# Altium schematic sheet BMS_V4.SchDoc
size A; SheetNumber: 1; SheetTotal: 1
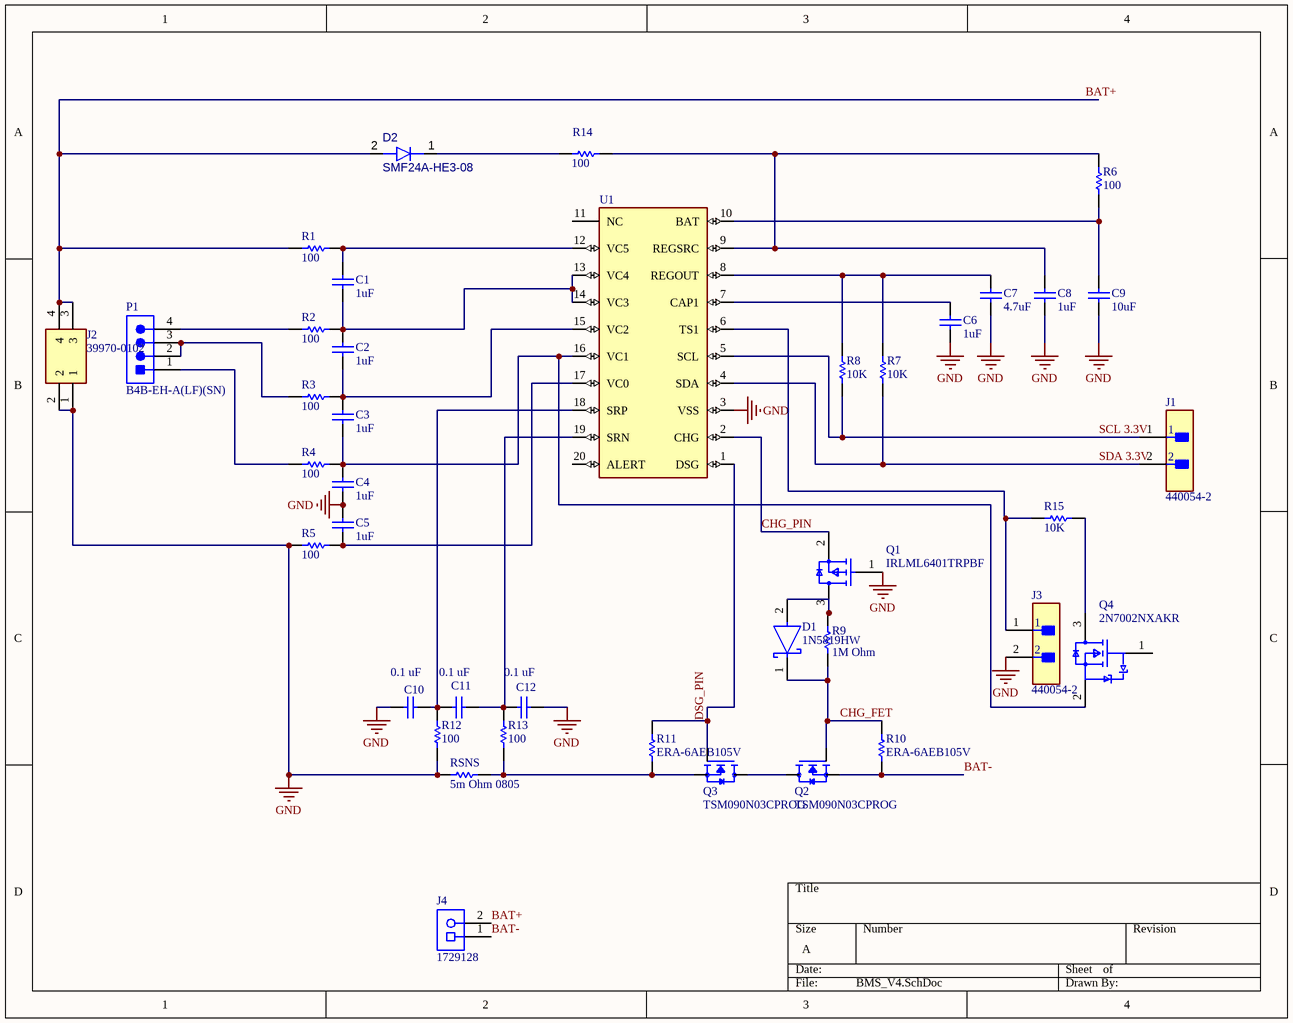
[diagram p0: BMS_V4.SchDoc]

## Parts
C1  1uF  [CAPC2013X140X50LL20T25]
C2  1uF  [CAPC2013X140X50LL20T25]
C3  1uF  [CAPC2013X140X50LL20T25]
C4  1uF  [CAPC2013X140X50LL20T25]
C5  1uF  [CAPC2013X140X50LL20T25]
C6  1uF  [CAPC2013X140X50LL20T25]
C7  4.7uF  [CAPC2013X140X50LL20T25]
C8  1uF  [CAPC2013X140X50LL20T25]
C9  10uF  [CAPC2013X140X50LL20T25]
C10  0.1 uF  [CAPC2013X140X50LL20T25]
C11  0.1 uF  [CAPC2013X140X50LL20T25]
C12  0.1 uF  [CAPC2013X140X50LL20T25]
D1  1N5819HW  [FP-SOD123-IPC_A]
D2  SMF24A-HE3-08  [DIOM2818X11N]
J1  440054-2  [FP-440054-2-MFG]
J2  39970-0102  [399700102]
J3  440054-2  [FP-440054-2-MFG]
J4  1729128  [PHOE-1729128-2_V]
P1  B4B-EH-A(LF)(SN)  [JST-B4B-EH-A_V]
Q1  IRLML6401TRPBF  [FP-SOT23-MFG]
Q2  TSM090N03CPROG  [TRANS_TSM090N03CPROG]
Q3  TSM090N03CPROG  [TRANS_TSM090N03CPROG]
Q4  2N7002NXAKR  [FP-SOT23-IPC_B]
R1  100  [RESC2013X60X30ML20T20]
R2  100  [RESC2013X60X30ML20T20]
R3  100  [RESC2013X60X30ML20T20]
R4  100  [RESC2013X60X30ML20T20]
R5  100  [RESC2013X60X30ML20T20]
R6  100  [RESC2013X60X30ML20T20]
R7  10K  [RESC2013X60X30ML20T20]
R8  10K  [RESC2013X60X30ML20T20]
R9  1M Ohm  [RESC2013X60X40LL20T25]
R10  ERA-6AEB105V  [RESC2013X60X40LL20T25]
R11  ERA-6AEB105V  [RESC2013X60X40LL20T25]
R12  100  [RESC2013X50X30LL20T20]
R13  100  [RESC2013X50X30LL20T20]
R14  100  [RESC2013X60X30ML20T20]
R15  10K  [RESC2013X60X35NL10T20]
RSNS  5m Ohm 0805  [RESC2013X60X30ML20T20]
U1  (no value)  [BQ7692006PW]

## Nets
GND: C4.1 C5.2 C6.1 C7.1 C8.1 C9.1 C10.2 C12.1 J2.1 J2.2 J3.2 Q1.1(G) R5.1 R12.1 RSNS.2 U1.3(VSS)
BAT+: D2.2(A) J2.3 J2.4 J4.2 R1.1
BAT-: J4.1 Q2.3(S) R10.1
CHG_FET: D1.1(C) Q2.1(G) R9.1 R10.2
CHG_PIN: Q1.2(S) U1.2(CHG)
DSG_PIN: Q3.1(G) R11.2 U1.1(DSG)
SCL 3.3V: J1.1 R8.1 U1.5(SCL)
SDA 3.3V: J1.2 R7.1 U1.4(SDA)
NetC1_1: C1.1 C2.2 R2.2 U1.13(VC4) U1.14(VC3)
NetC1_2: C1.2 R1.2 U1.12(VC5)
NetC2_1: C2.1 C3.2 R3.2 U1.15(VC2)
NetC3_1: C3.1 C4.2 Q4.2(S) R4.2 U1.16(VC1)
NetC5_1: C5.1 R5.2 U1.17(VC0)
NetC6_2: C6.2 U1.7(CAP1)
NetC7_2: C7.2 R7.2 R8.2 U1.8(REGOUT)
NetC8_2: C8.2 R6.2 R14.1 U1.9(REGSRC)
NetC9_2: C9.2 R6.1 U1.10(BAT)
NetC10_1: C10.1 C11.2 R12.2 U1.18(SRP)
NetC11_1: C11.1 C12.2 R13.2 U1.19(SRN)
NetD1_2: D1.2(A) Q1.3(D) R9.2
NetD2_1: D2.1(K) R14.2
NetJ3_1: J3.1 R15.1 U1.6(TS1)
NetP1_1: P1.1 R4.1
NetP1_2: P1.2 P1.3 R3.1
NetP1_4: P1.4 R2.1
NetQ2_2: Q2.2(D) Q3.2(D)
NetQ3_3: Q3.3(S) R11.1 R13.1 RSNS.1
NetQ4_3: Q4.3(D) R15.2

Not connected (* = marked no-connect by the designer): Q4 1(G); U1 11(NC) 20(ALERT)

## Library data of the parts
C1-C12 = CMP-2007-03234-1: Part Number: C0805C105K3RACTU; Manufacturer: Kemet
D1 = CMP-0303-00003-3: DIODE SCHOTTKY 40V 1A SOD123; Forward Voltage: 450mV; Capacitance: 110pF; Max Forward Surge Current (Ifsm): 25A; Peak Reverse Current: 50uA; Polarity: Standard; Element Configuration: Single; Max Power Dissipation: 450mW; Min Operating Temperature: -65°C; Package Quantity: 3000; Contact Plating: Tin; Weight: 0.000353oz; Max Repetitive Reverse Voltage (Vrrm): 40V; Max Reverse Voltage (DC): 40V; Height: 1.25mm; Average Rectified Current: 1A; Width: 1.7mm; Case/Package: SOD-123-2; Lead Free: Lead Free; Max Operating Temperature: 125°C; Current Rating: 1A; Termination: SMD/SMT; Forward Current: 1A; Radiation Hardening: No; Number of Pins: 2; Length: 2.85mm; Voltage Rating (DC): 40V; REACH SVHC: No SVHC; Peak Non-Repetitive Surge Current: 25A; Packaging: Tape and Reel; Output Current: 1A
D2 = CMP-004-00031-1: Trans Voltage Suppressor Diode, 1000W, 24V V(RWM), Unidirectional, 1 Element, Silicon, DO-219AB; RoHS Compliant: Yes; Pins: 2; Min Operating Temperature: -55°C; Max Operating Temperature: 150°C
J1 J3 = CMP-03369-000005-1: CONN HEADER VERT 2POS 2MM; Manufacturer: TE Connectivity; Conn Gender: Male; Conn Orientation: Vertical; Voltage Rating: 250V; Number Of Contacts: 2; Current Rating: 3A; ComponentLink2Description: Datasheet; Temperature Range Low: -25°C; Contact Material: Tin,Nickel; Device Class L3: unset; Digikey Description: CONN HEADER VERT 2POS 2MM; Temperature: -25°C to +85°C; Mouser Description: Headers & Wire Housings 2.0mm HDR 2pos VERT HPI; Manufacturer Part Number: 440054-2; Package: 440054-2; Lead Free: Yes; ComponentLink2URL: https://www.te.com/usa-en/product-440054-2.datasheet.pdf; Number Of Rows: 1; Octopart: https://octopart.com/440054-2-te+connectivity-40237927; Category: Conn; Temperature Range High: +85°C; Footprint Url: https://www.te.com/commerce/DocumentDelivery/DDEController?Action=showdoc&DocId=Customer+Drawing%7F440054%7FF6%7Fpdf%7FEnglish%7FENG_CD_440054_F6.pdf%7F440054-2; Pitch: 2mm; Device Class L1: Connectors; RoHS: TRUE; Height: 6.35mm; Device Class L2: Headers and Wire Housings; Automotive: No
J2 = 39970-0102: 10.16mm Beau Eurostyle Fixed Mount PCB Terminal Block, High Power 40A,  Circuits; Manufacturer_Name: Molex; Geometry.Height: 30mm; Manufacturer_Part_Number: 39970-0102; Mouser Part Number: 538-39970-0102; Mouser Price/Stock: https://www.mouser.co.uk/ProductDetail/Molex/39970-0102?qs=E1QQzziZK0%252BNAsw%2FMf08Pw%3D%3D; Arrow Part Number: *; Arrow Price/Stock: *; Datasheet Link: https://www.molex.com/pdm_docs/sd/399700102_sd.pdf
J4 = CMP-2000-05815-1: PCB Terminal Block, 13.5 A, 400 V, 2-Pin THD, RoHS, Bulk; Manufacturer: Phoenix Contact; Package Version: 03/2015; No. of Rows: 1; Pitch: 5.08mm; No. of Positions: 2; Voltage Rating: 400V; Current Rating: 13500mA; Manufacturer URL: http://www.phoenixcontact.com/; Datasheet URL: https://datasheet.ciiva.com/16046/1729128-16046181.pdf; RoHS: TRUE; Package URL: https://www.phoenixcontact.com/online/portal/pi/pxc/product_detail_page/!ut/p/b1/3VdJjqNKFDxLH8AFycySyWY2ozFsEPOMMQaDOX1XedGL_1Vdm5YXJleknhSKeBkvI6EA8ncAo3AYoDhBQGco6KN7VURTdemj9us_IEKEZo_YHiPAEWEFmDGOHMORkqKYCORBZxgL7ZoaZYcbFFUZ3fqxSY6GOuxydWUuHqz1ynmMFygu583Bob0Ewr6Sd_l-5m-kAueHiB0jpRwZwe58wwtkpxtMYd_LmGcDRU02dRNEyWt6Y2ti5pSyJ_reIkzIulrqApdnbT11V5jnCKbYNCvhEM1MCpPByat_X379-iThf08CI5GfOPqfBeS3BRoBOdD55AKVv0iLwCMq-2BrzXWSGRH7pUGD9uwXQjiph3xL0DKQwdGa0JImiIOmBNOestqgwTHSSs2oOep-78apyXQBvNi8ZLaFjvjWvcaUEBu0MC6Wbe-d6mB0FAebo2lUWinqYaZs5DAYzV0RP9yitUjnGJ0iI9xhZkT42OCQNUJJhkgWINNQLP2JFP6OpMg3JCVg70jqHT0lvKOnhHf0lPuOnnLf0VPuWx6_dxwUIvwk5WMkT0kLL1mh61l2yZVSzG3pYV_bqo-mj6uMKwKwdnnW8Jh5RTOJzMOA5c-eJDaZQw4mTMPH02PvS_ZAqNVjVTo2WyYLkwH_KU1mmmG5kjRhDqPXLwwVHvVOjCM60-fpXvTDfMGW1PVFVS1r4e4yVDk4ZdNbkUHvqPqQSeian4UD39fNKmachqdJ1NJbyk8rXT9mXTvPk3oE5meulKGgiruPJek-4I9hTT6G8ZLOyRSm2RRVbThERQad5OS28hdt4YW4vG0stgYYzsWsK4_7y6DZMjJSCqri1kyiZR5vD7pwIrNR7QwPHTcLTI5qT7eRlpHrdGiupYlqQDJ7zy_CND8fWWBoLRXxk1RVcXiBQwbTD4Xi7KL-FuO94t9xaqweXzH; PartNumber: 1729128; Package Description: 2-Pin Through Hole Device, Body 8.1 x 10.16 mm, Pitch 5.08 mm; Datasheet Version: 12/2013; Mounting Technology: ThroughHole; Orientation: Horizontal; Package Reference: 1729128-2; Packing: Bulk
P1 = CMP-2000-05904-1: Male Header, Pitch 2.5 mm, 1 x 4 Position, Height 6 mm, Tail Length 3.2 mm, -25 to 85 degC, RoHS, Bulk; Manufacturer: JST; Style/Orientation: StraightHeader/Plug; Pitch: 2.5mm; No of Positions: 4; Mounting Technology: SurfaceMount; Package Description: Male Header, Pitch 2.5 mm, 1 x 4 Position, Height 6 mm, Tail Length 3.2 mm; Datasheet Version: 12/2012; Type: ShroudedHeader; Package Reference: B4B-EH-A; Manufacturer URL: http://www.jst.com/home2.html; Termination: Crimp; Datasheet URL: http://www.jst-mfg.com/product/pdf/eng/eEH.pdf
Q1 = CMP-32901-000098-1: MOSFET P-CH 12V 4.3A SOT-23; Manufacturer: Infineon; Drain To Source Resistance: 0.05Ω; Pulse Drain Current: -34A; Reverse Recovery Time: 22ns; Depletion Mode: False; Gate To Source Voltage: 8V; Number Of P Channels: 1; Turn Off Delay Time: 250ns; Gate Charge At Vgs: 10nC @ -5V; Max Forward Diode Voltage: -1.2V; Input Capacitace At Vds: 830pF @ -10V; Turn On Delay Time: 11ns; Drain To Source Voltage: -12V; Rthja Max: 75°C/W; Max Junction Temp: +150°C; Standoff Height: 0.01mm; Continuous Drain Current: -4.3A; Power Dissipation: 1.3W; Threshold Vgs Max: -0.95V; Reverse Recovery Charge: 8nC; Threshold Vgs Min: -0.4V; Digikey Description: MOSFET P-CH 12V 4.3A SOT-23; RoHS: TRUE; ComponentLink2Description: Datasheet; Device Class L1: Discrete Semiconductors; Package: SOT23; Octopart: https://octopart.com/irlml6401trpbf-infineon-65874987; Temperature Range High: +150°C; Manufacturer Part Number: IRLML6401TRPBF; Automotive: No; Category: Trans; Temperature: -55°C to +150°C; Device Class L2: Transistors; Height: 1.12mm; Ipc Land Pattern Name: SOT95P237X100-3; Device Class L3: MOSFETs; Number Of Channels: 1; ComponentLink2URL: https://www.infineon.com/dgdl/irlml6401pbf.pdf?fileId=5546d462533600a401535668b96d2634; Lead Free: Yes; Drain To Source Breakdown Voltage: -12V; Temperature Range Low: -55°C
Q2 Q3 = CMP-013-00034-1: N-Channel 30 V 50A (Tc) 40W (Tc) Surface Mount TO-252 (DPAK); MF: Taiwan Semiconductor; Case/Package: TO-252-3 Taiwan Semiconductor; Design Item ID: TSM090N03CPROG; Value: *; Pins: 3; Check_prices: https://www.snapeda.com/parts/TSM090N03CPROG/taiwan/view-part/?ref=eda; MP: TSM090N03CPROG; SnapEDA_Link: https://www.snapeda.com/parts/TSM090N03CPROG/taiwan/view-part/?ref=snap; Source: TSM090N03CPROG.SchLib; Component Type: Standard
Q4 = CMP-14409-000026-2: 2N7002NXAK/SOT23/TO-236AB
R1-R8 R14 RSNS = CMP-2001-01991-1: Part Number: RK73H2ATTD1000F; Manufacturer: KOA Speer
R9 = CMP-2001-00584-1: Part Number: ERA-6AEB105V; Manufacturer: Panasonic
R10 R11 = CMP-2001-00584-1: Manufacturer: Panasonic; Part Number: ERA-6AEB105V
R12 R13 = CMP-2001-04901-1: Manufacturer: Vishay Dale; Part Number: CRCW0805100RFKEA
R15 = CMP-1659-00013-4: Chip Resistor, 10 KOhm, +/- 1%, 0.125 W, -55 to 155 degC, 0805 (2012 Metric), RoHS, Tape and Reel; Manufacturer: Yageo; Voltage Rating: 150 V; Mount: Surface Mount; ComponentLink1Description: Manufacturer URL; ComponentLink2URL: http://www.yageo.com/documents/recent/PYu-RC_Group_51_RoHS_L_04.pdf; Pins: 2; Length: 2 mm; Min Operating Temperature: -55 degC; Height: 0.5 mm; Mounting Technology: Surface Mount; RoHSCompliant: true; REACH SVHC: No SVHC; ComponentLink1URL: http://www.yageo.com/; Max Operating Temperature: 155 degC; PackageReference: 0805; DatasheetVersion: Rev. 4, 02/2016; Package Quantity: 5000; Packaging: Tape and Reel; ComponentLink2Description: Datasheet; PackageDescription: 2-Pin Surface Mounted Device, Body 2 x 1.25 mm
U1 = CMP-031-00007-1: 3 to 5-Series Cell Li-Ion and Li-Phosphate Battery Monitor (bq76940 Family); MF: Texas Instruments; Pins: 20; Component Type: Standard; Design Item ID: BQ7692006PW; Value: *; SnapEDA_Link: https://www.snapeda.com/parts/BQ7692006PW/Texas+Instruments/view-part/?ref=snap; MP: BQ7692006PW; Check_prices: https://www.snapeda.com/parts/BQ7692006PW/Texas+Instruments/view-part/?ref=eda; Case/Package: TSSOP-20 Texas Instruments; Source: BQ7692006PW.SchLib